# Altium schematic sheet DSP1.SchDoc
size A
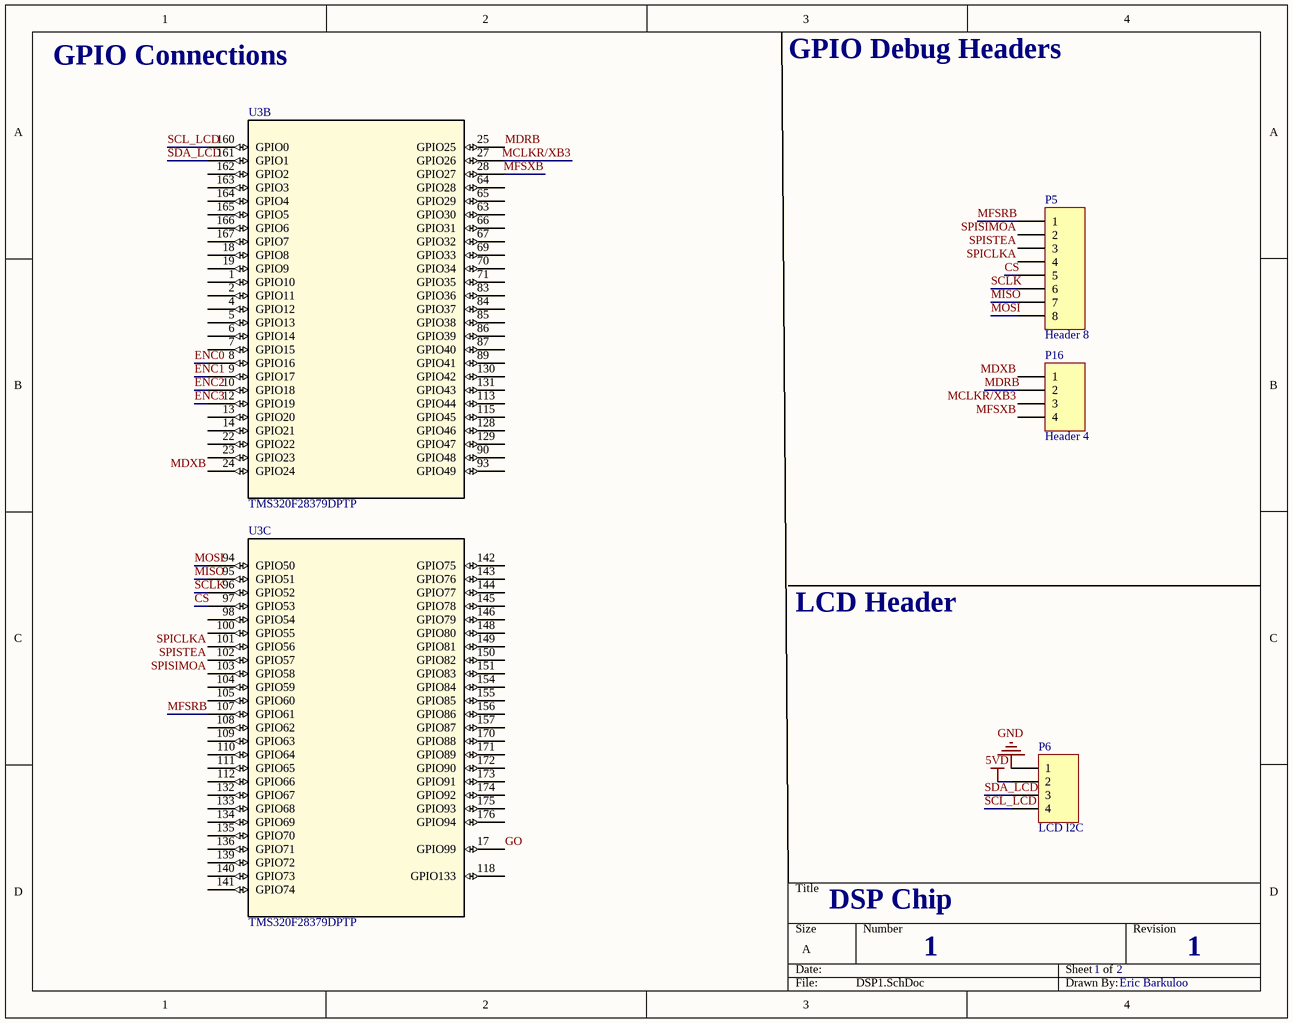
[diagram p0: DSP1.SchDoc]

## Parts
P5  Header 8  [HDR1X8]
P6  LCD I2C  [HDR1X4]
P16  Header 4  [HDR1X4]
U3  TMS320F28379DPTP  [PTP0176F_N]  (parts B,C of 5)

## Nets
5VD: P6.2
GND: P6.1
CS: P5.5 U3.97(GPIO53)
ENC0: U3.8(GPIO16)
ENC1: U3.9(GPIO17)
ENC2: U3.10(GPIO18)
ENC3: U3.12(GPIO19)
GO: U3.17(GPIO99)
MCLKR/XB3: P16.3 U3.27(GPIO26)
MDRB: P16.2 U3.25(GPIO25)
MDXB: P16.1 U3.24(GPIO24)
MFSRB: P5.1 U3.107(GPIO61)
MFSXB: P16.4 U3.28(GPIO27)
MISO: P5.7 U3.95(GPIO51)
MOSI: P5.8 U3.94(GPIO50)
SCL_LCD: P6.4 U3.160(GPIO0)
SCLK: P5.6 U3.96(GPIO52)
SDA_LCD: P6.3 U3.161(GPIO1)
SPICLKA: P5.4 U3.101(GPIO56)
SPISIMOA: P5.2 U3.103(GPIO58)
SPISTEA: P5.3 U3.102(GPIO57)

Not connected (* = marked no-connect by the designer): U3 1(GPIO10) 2(GPIO11) 4(GPIO12) 5(GPIO13) 6(GPIO14) 7(GPIO15) 13(GPIO20) 14(GPIO21) 18(GPIO8) 19(GPIO9) 22(GPIO22) 23(GPIO23) 63(GPIO30) 64(GPIO28) 65(GPIO29) 66(GPIO31) 67(GPIO32) 69(GPIO33) 70(GPIO34) 71(GPIO35) 83(GPIO36) 84(GPIO37) 85(GPIO38) 86(GPIO39) 87(GPIO40) 89(GPIO41) 90(GPIO48) 93(GPIO49) 98(GPIO54) 100(GPIO55) 104(GPIO59) 105(GPIO60) 108(GPIO62) 109(GPIO63) 110(GPIO64) 111(GPIO65) 112(GPIO66) 113(GPIO44) 115(GPIO45) 118(GPIO133) 128(GPIO46) 129(GPIO47) 130(GPIO42) 131(GPIO43) 132(GPIO67) 133(GPIO68) 134(GPIO69) 135(GPIO70) 136(GPIO71) 139(GPIO72) 140(GPIO73) 141(GPIO74) 142(GPIO75) 143(GPIO76) 144(GPIO77) 145(GPIO78) 146(GPIO79) 148(GPIO80) 149(GPIO81) 150(GPIO82) 151(GPIO83) 154(GPIO84) 155(GPIO85) 156(GPIO86) 157(GPIO87) 162(GPIO2) 163(GPIO3) 164(GPIO4) 165(GPIO5) 166(GPIO6) 167(GPIO7) 170(GPIO88) 171(GPIO89) 172(GPIO90) 173(GPIO91) 174(GPIO92) 175(GPIO93) 176(GPIO94)

## Notes on the sheet
- GPIO Connections
- GPIO Debug Headers
- LCD Header
- DSP Chip
- 1
- 2
- Eric Barkuloo

## Library data of the parts
P5 = Header 8: Header, 8-Pin; LatestRevisionDate: 17-Jul-2002; LatestRevisionNote: Re-released for DXP Platform.; Publisher: Altium Limited
P6 P16 = Header 4: Header, 4-Pin; LatestRevisionDate: 17-Jul-2002; LatestRevisionNote: Re-released for DXP Platform.; Publisher: Altium Limited
U3 = TMS320F28379DPTP: Imported; PartNumber: TMS320F28379DPTPS; Manufacturer: Texas Instruments; RefDes: RefDes; TYPE: TYPE; Value: Value